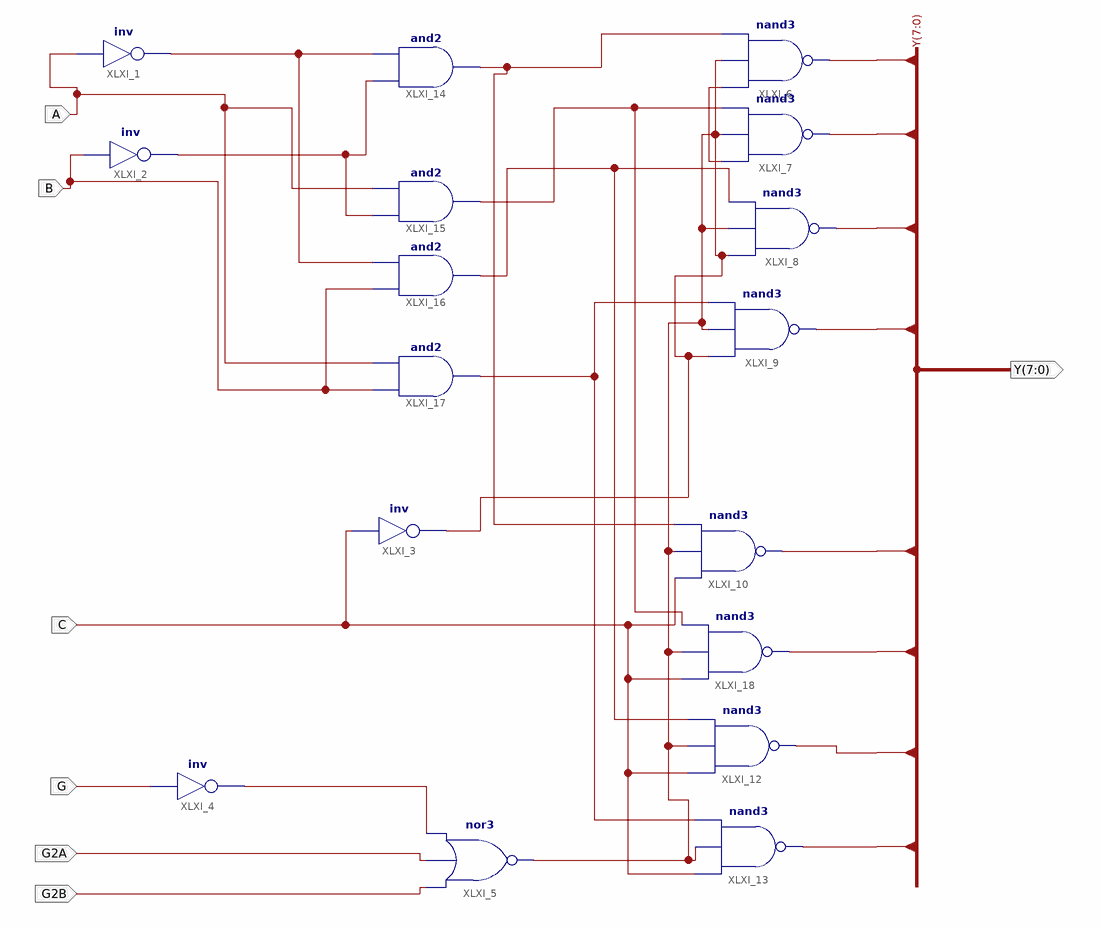
[diagram p0: schematic sheet 1]
// Xilinx ISE schematic D74LS1.sch (kintex7) as structural Verilog: 17 symbols, 7 ports
module D74LS1 (
  input  A,
  input  B,
  input  C,
  input  G,
  input  G2A,
  input  G2B,
  output [7:0] Y
);

  wire XLXN_37, XLXN_47, XLXN_55, XLXN_56, XLXN_57, XLXN_60, XLXN_61, XLXN_63, XLXN_70;

  not XLXI_1 (XLXN_63, A);
  not XLXI_2 (XLXN_70, B);
  not XLXI_3 (XLXN_60, C);
  not XLXI_4 (XLXN_37, G);
  nor XLXI_5 (XLXN_60, G2B, G2A, XLXN_37);
  nand XLXI_6 (Y[0], XLXN_57, XLXN_60, XLXN_61);
  nand XLXI_7 (Y[1], XLXN_57, XLXN_60, XLXN_56);
  nand XLXI_8 (Y[2], XLXN_60, XLXN_60, XLXN_55);
  nand XLXI_9 (Y[3], XLXN_60, XLXN_60, XLXN_47);
  nand XLXI_10 (Y[4], C, XLXN_60, XLXN_61);
  nand XLXI_12 (Y[6], C, XLXN_60, XLXN_55);
  nand XLXI_13 (Y[7], C, XLXN_60, XLXN_47);
  and XLXI_14 (XLXN_61, XLXN_70, XLXN_63);
  and XLXI_15 (XLXN_56, XLXN_70, A);
  and XLXI_16 (XLXN_55, B, XLXN_63);
  and XLXI_17 (XLXN_47, B, A);
  nand XLXI_18 (Y[5], C, XLXN_60, XLXN_56);
endmodule
